# Altium project ProPatch Panel.PrjPcb
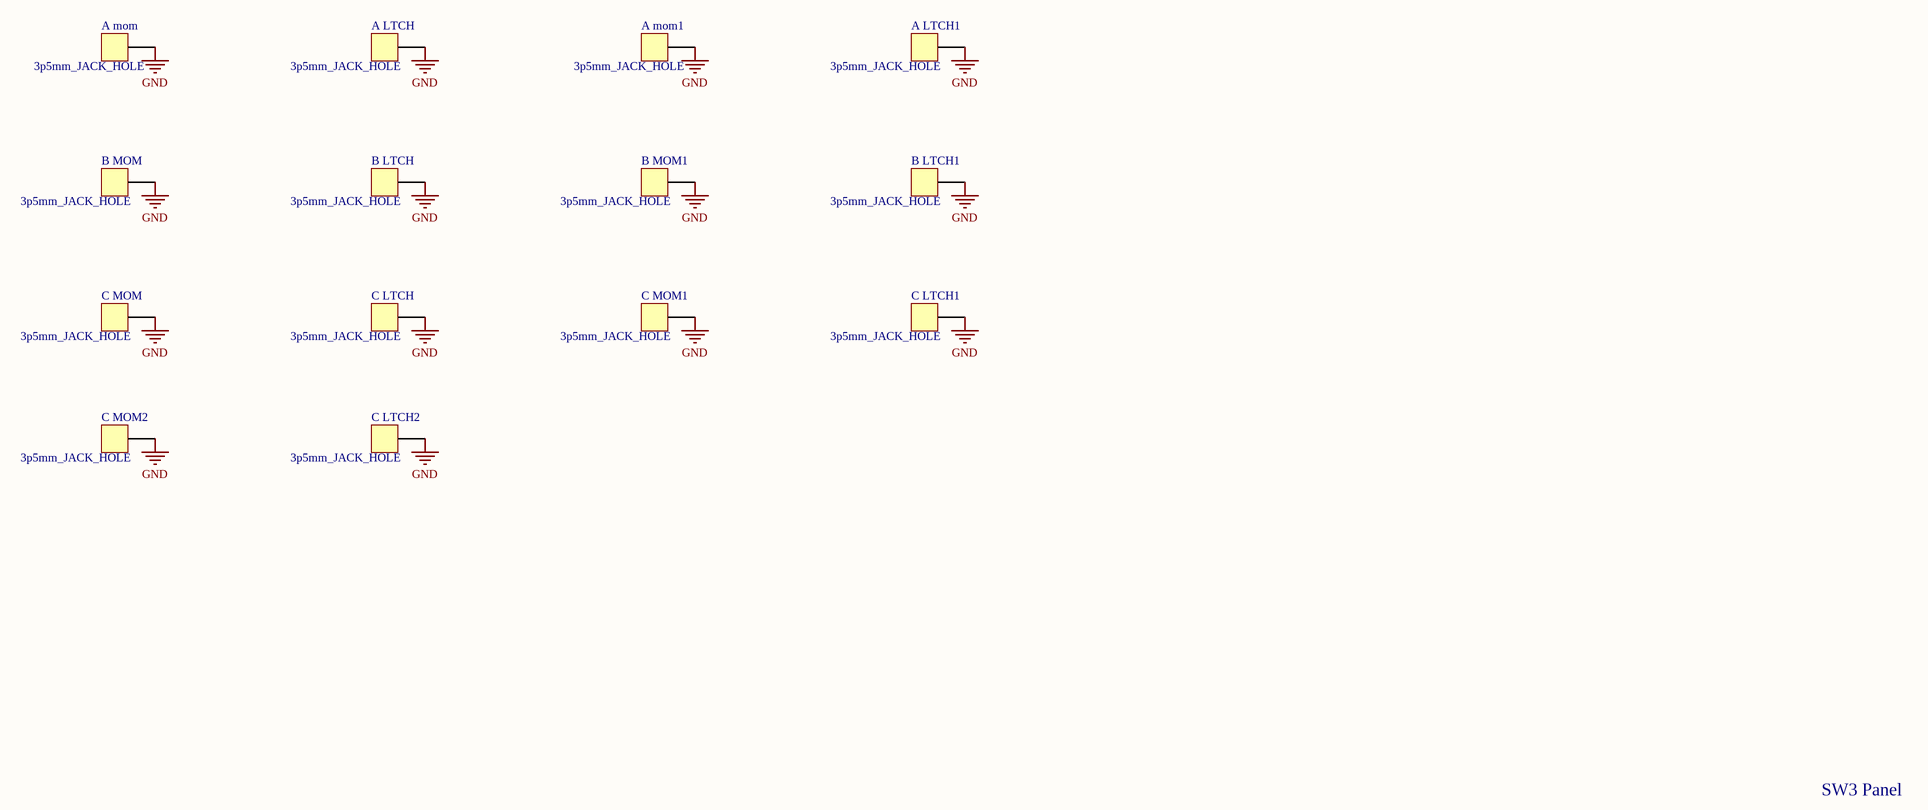
[diagram p0: ProPatch Panel.SchDoc]
LeadEngineer: JCF; HardRev: A; Codename: ProPatch; BOMRev: A
1 sheet, 14 parts. Net scope: global (net labels, ports and power ports of the same name join across sheets).
Board file: ProPatch Panel.PcbDoc

## Sheet ProPatch Panel.SchDoc
size C; SheetNumber: 1; SheetTotal: 1

### Parts
A_LTCH  3p5mm_JACK_HOLE  [3p5mm_JACK_HOLE]
A_LTCH1  3p5mm_JACK_HOLE  [3p5mm_JACK_HOLE]
A_mom  3p5mm_JACK_HOLE  [3p5mm_JACK_HOLE]
A_mom1  3p5mm_JACK_HOLE  [3p5mm_JACK_HOLE]
B_LTCH  3p5mm_JACK_HOLE  [3p5mm_JACK_HOLE]
B_LTCH1  3p5mm_JACK_HOLE  [3p5mm_JACK_HOLE]
B_MOM  3p5mm_JACK_HOLE  [3p5mm_JACK_HOLE]
B_MOM1  3p5mm_JACK_HOLE  [3p5mm_JACK_HOLE]
C_LTCH  3p5mm_JACK_HOLE  [3p5mm_JACK_HOLE]
C_LTCH1  3p5mm_JACK_HOLE  [3p5mm_JACK_HOLE]
C_LTCH2  3p5mm_JACK_HOLE  [3p5mm_JACK_HOLE]
C_MOM  3p5mm_JACK_HOLE  [3p5mm_JACK_HOLE]
C_MOM1  3p5mm_JACK_HOLE  [3p5mm_JACK_HOLE]
C_MOM2  3p5mm_JACK_HOLE  [3p5mm_JACK_HOLE]

### Nets
GND: A_LTCH.1 A_LTCH1.1 A_mom.1 A_mom1.1 B_LTCH.1 B_LTCH1.1 B_MOM.1 B_MOM1.1 C_LTCH.1 C_LTCH1.1 C_LTCH2.1 C_MOM.1 C_MOM1.1 C_MOM2.1

### Notes on the sheet
- SW3 Panel
- Title:
- This work is licensed under a Creative Commons Attribution 4.0 International License. Derivative works should remove all Sophistry branding and ‘é’ watermark.
- Date:
- Engineer:
- Revision:
- Codename:
- Time:
- Variant:
- Sheet
- of

### Library data of the parts
A_LTCH A_LTCH1 A_mom A_mom1 B_LTCH B_LTCH1 B_MOM B_MOM1 C_LTCH C_LTCH1 C_LTCH2 C_MOM C_MOM1 C_MOM2 = 3p5mm_JACK_HOLE: PartNumber: 3p5mm_JACK_HOLE; Manufacturer Part Number: 3p5mm_JACK_HOLE